# Altium schematic sheet HVSUP_ISOL.schdoc: HVPSU_ISOL v1.0
size 420 x 297 mm; EDA_Number: ARTIQ; Projet: HVPSU_ISOL; Author: G.Kasprowicz; CompanyName: WUT ISE; DrawnBy: G.Kasprowicz; Organization: WUT ISE; Address1: PW ISE; Address2: Nowowiejska 15/19 00-665 Warsaw; Address3: gkasprow@gmail.com; DocumentNumber: 1; Revision: 1.0; SheetNumber: 1; SheetTotal: 11; ModifiedBy: -; CheckedDate: -; Title2: Top; DivGrp: WUT ISE; Designer: G.Kasprowicz; ModifiedDate: -; ProjectName: Sensor Box
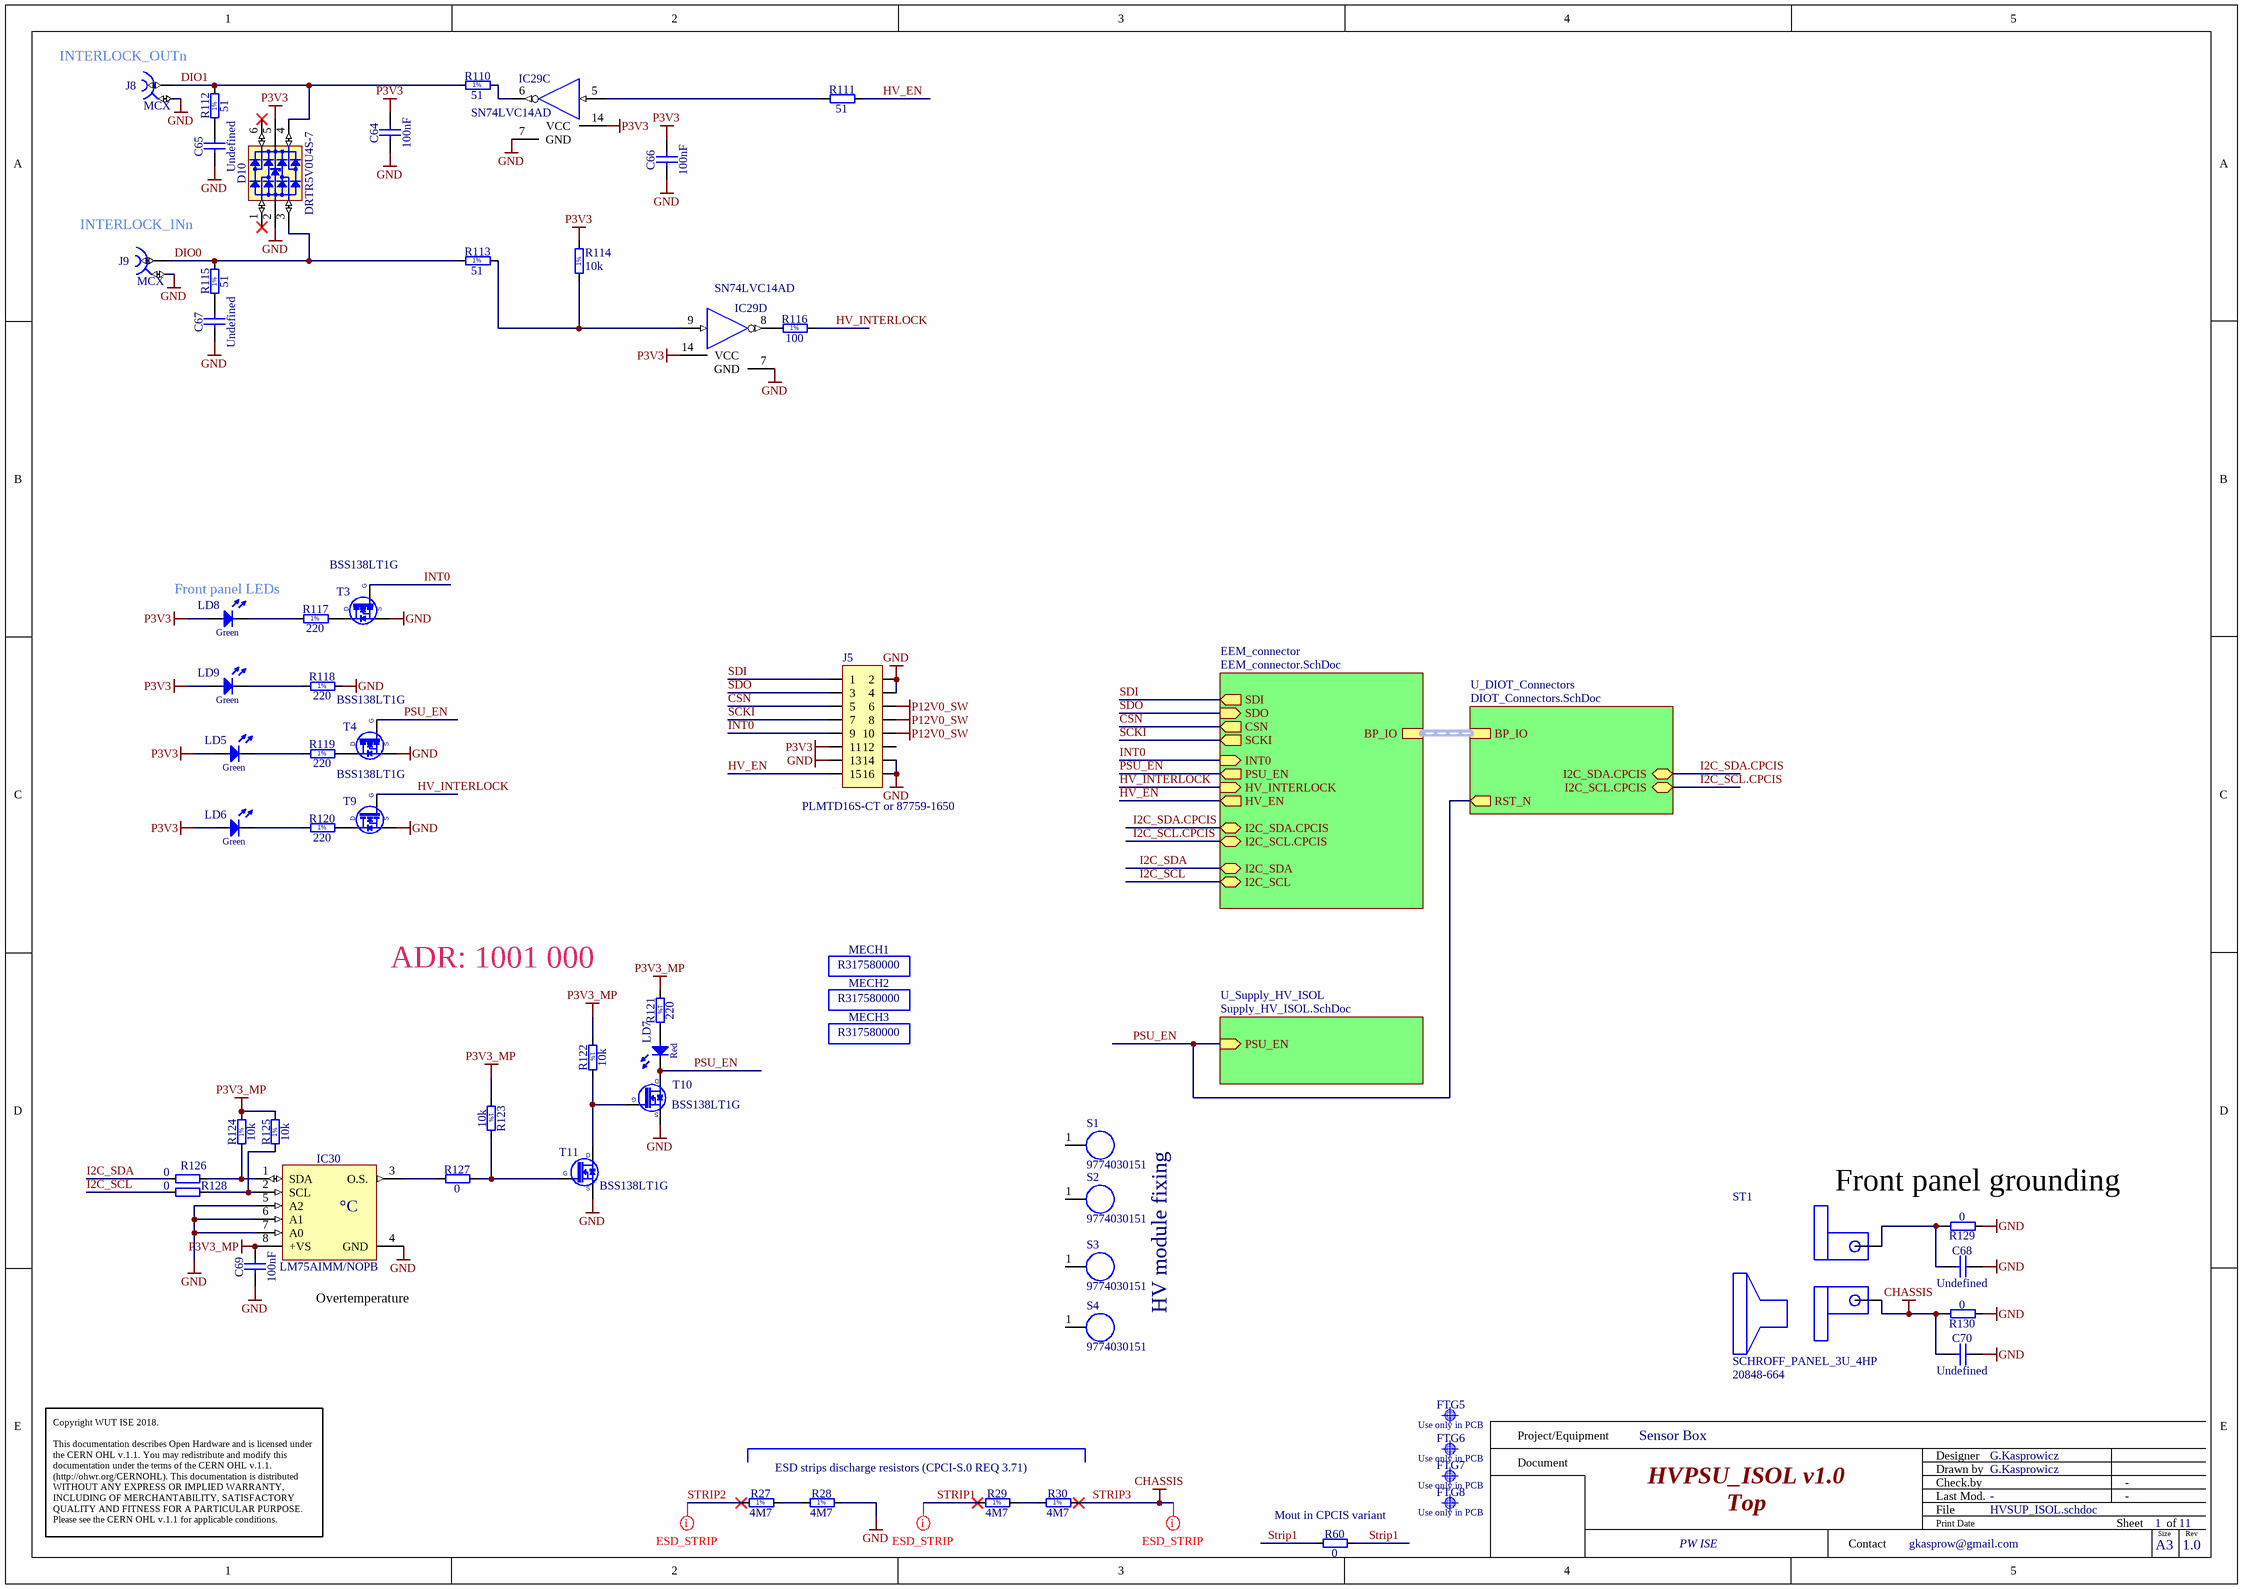
[diagram p0: HVSUP_ISOL.schdoc]

## Parts
C64  100nF  [CAPC1005X55N]
C65  Undefined  [CAPC1608X90N]
C66  100nF  [CAPC1005X55N]
C67  Undefined  [CAPC1608X90N]
C68  Undefined  [CAPC2012X135N]
C69  100nF  [CAPC1005X55N]
C70  Undefined  [CAPC2012X135N]
D10  DRTR5V0U4S-7  [SOT65P210X110-6N]
FTG5  Use only in PCB  [FIDUCIAL_TOP_C100-200]  (no BOM)
FTG6  Use only in PCB  [FIDUCIAL_TOP_S100-200]  (no BOM)
FTG7  Use only in PCB  [FIDUCIAL_TOP_S100-200]  (no BOM)
FTG8  Use only in PCB  [FIDUCIAL_TOP_S100-200]  (no BOM)
IC29  SN74LVC14AD  [SOIC127P600X175-14N]  (parts C,D of 6)
IC30  LM75AIMM/NOPB  [SOP65P490X109-8N]
J5  PLMTD16S-CT or 87759-1650  [87759-1650]
J8  MCX  [AMPHENOL_919-383J-51A]
J9  MCX  [AMPHENOL_919-383J-51A]
LD5  Green  [LED_DIALIGHT_555-230]
LD6  Green  [LED_DIALIGHT_555-230]
LD7  Red  [LED_DIALIGHT_555-200]
LD8  Green  [LED_DIALIGHT_555-230]
LD9  Green  [LED_DIALIGHT_555-230]
MECH1  R317580000  [GENERIC_MECH]
MECH2  R317580000  [GENERIC_MECH]
MECH3  R317580000  [GENERIC_MECH]
R27  4M7  [RESC2113X55N]
R28  4M7  [RESC2113X55N]
R29  4M7  [RESC2113X55N]
R30  4M7  [RESC2113X55N]
R60  0  [RESC2012X60N]
R110  51  [RESC1005X40N]
R111  51  [RESC1005X40N]
R112  51  [RESC1005X40N]
R113  51  [RESC1005X40N]
R114  10k  [RESC1005X40N]
R115  51  [RESC1005X40N]
R116  100  [RESC1005X40N]
R117  220  [RESC1608X55N]
R118  220  [RESC1608X55N]
R119  220  [RESC1608X55N]
R120  220  [RESC1608X55N]
R121  220  [RESC1608X55N]
R122  10k  [RESC1005X40N]
R123  10k  [RESC1005X40N]
R124  10k  [RESC1005X40N]
R125  10k  [RESC1005X40N]
R126  0  [RESC1005X40N]
R127  0  [RESC1005X40N]
R128  0  [RESC1005X40N]
R129  0  [RESC1608X55N]
R130  0  [RESC1608X55N]
S1  9774030151  [9774030151]
S2  9774030151  [9774030151]
S3  9774030151  [9774030151]
S4  9774030151  [9774030151]
ST1  SCHROFF_PANEL_3U_4HP  Manufacturer Part Number 2: 20848-664  [SCHROFF_PANEL_3HP_4U]
T3  BSS138LT1G  [SOT95P240X110-3N]
T4  BSS138LT1G  [SOT95P240X110-3N]
T9  BSS138LT1G  [SOT95P240X110-3N]
T10  BSS138LT1G  [SOT95P240X110-3N]
T11  BSS138LT1G  [SOT95P240X110-3N]

## Sub-sheets
EEM_connector = EEM_connector.SchDoc: SCKI (out), SDI (out), CSN (out), SDO (in), INT0 (in), PSU_EN (out), HV_INTERLOCK (in), HV_EN (out), BP_IO (harness BP_Conn), I2C_SDA.CPCIS (bidir), I2C_SCL.CPCIS (bidir), I2C_SDA (bidir), I2C_SCL (bidir)
U_DIOT_Connectors = DIOT_Connectors.SchDoc: BP_IO (harness BP_Conn), I2C_SDA.CPCIS (bidir), I2C_SCL.CPCIS (bidir), RST_N (out)
U_Supply_HV_ISOL = Supply_HV_ISOL.SchDoc: PSU_EN (in)

## Nets
GND: C64.1 C65.1 C66.1 C67.1 C68.2 C69.1 C70.2 D10.2(GND) IC29.7(GND) IC30.4(GND) IC30.5(A2) IC30.6(A1) IC30.7(A0) J5.2 J5.4 J5.13 J5.14 J5.16 J8.2 J9.2 R28.2 R118.2 R129.1 R130.1 T3.2(S) T4.2(S) T9.2(S) T10.2(S) T11.2(S)
P3V3: C64.2 C66.2 D10.5(VBUS) IC29.14(VCC) J5.11 LD5.2(A) LD6.2(A) LD8.2(A) LD9.2(A) R114.2
P3V3_MP: C69.2 IC30.8(+VS) R121.1 R122.1 R123.1 R124.2 R125.2
P12V0_SW: J5.6 J5.8 J5.10
STRIP3: C70.1 R30.2 R130.2 ST1.0  [also labelled CHASSIS]
CSN: J5.5 ; sheet EEM_connector/CSN
DIO0: D10.3(I/O2) J9.1 R113.1 R115.2
DIO1: D10.4(I/O3) J8.1 R110.1 R112.2
HV_EN: J5.15 R111.2 ; sheet EEM_connector/HV_EN
HV_INTERLOCK: R116.2 T9.1(G) ; sheet EEM_connector/HV_INTERLOCK
I2C_SCL: R128.1 ; sheet EEM_connector/I2C_SCL
I2C_SCL.CPCIS: sheet EEM_connector/I2C_SCL.CPCIS, sheet U_DIOT_Connectors/I2C_SCL.CPCIS
I2C_SDA: R126.1 ; sheet EEM_connector/I2C_SDA
I2C_SDA.CPCIS: sheet EEM_connector/I2C_SDA.CPCIS, sheet U_DIOT_Connectors/I2C_SDA.CPCIS
INT0: J5.9 T3.1(G) ; sheet EEM_connector/INT0
PSU_EN: LD7.1(C) T4.1(G) T10.3(D) ; sheet EEM_connector/PSU_EN, sheet U_Supply_HV_ISOL/PSU_EN, sheet U_DIOT_Connectors/RST_N
SCKI: J5.7 ; sheet EEM_connector/SCKI
SDI: J5.1 ; sheet EEM_connector/SDI
SDO: J5.3 ; sheet EEM_connector/SDO
STRIP1: R29.1 R60.1 R60.2
STRIP2: R27.1
NetC65_2: C65.2 R112.1
NetC67_2: C67.2 R115.1
NetC68_1: C68.1 R129.2 ST1.1
NetIC29_5: IC29.5(IN) R111.1
NetIC29_6: IC29.6(OUT) R110.2
NetIC29_8: IC29.8(OUT) R116.1
NetIC29_9: IC29.9(IN) R113.2 R114.1
NetIC30_1: IC30.1(SDA) R124.1 R126.2
NetIC30_2: IC30.2(SCL) R125.1 R128.2
NetIC30_3: IC30.3(O.S.) R127.1
NetLD5_1: LD5.1(C) R119.1
NetLD6_1: LD6.1(C) R120.1
NetLD7_2: LD7.2(A) R121.2
NetLD8_1: LD8.1(C) R117.1
NetLD9_1: LD9.1(C) R118.1
NetR27_2: R27.2 R28.1
NetR29_2: R29.2 R30.1
NetR117_2: R117.2 T3.3(D)
NetR119_2: R119.2 T4.3(D)
NetR120_2: R120.2 T9.3(D)
NetR122_2: R122.2 T10.1(G) T11.3(D)
NetR123_2: R123.2 R127.2 T11.1(G)

Not connected (* = marked no-connect by the designer): D10 1(I/O1)* 6(I/O4)*; J5 12; S1 1; S2 1; S3 1; S4 1

## Buses and harness runs
harness sheet EEM_connector/BP_IO = sheet U_DIOT_Connectors/BP_IO

## Layout directives
net class ESD_STRIP: STRIP1, STRIP2, STRIP3

## Notes on the sheet
- (near J8) INTERLOCK_OUTn
- (near J9) INTERLOCK_INn
- Front panel LEDs
- ADR: 1001 000
- (near R129) Front panel grounding
- Overtemperature
- HV module fixing
- ESD strips discharge resistors (CPCI-S.0 REQ 3.71)
- (near R60) Mout in CPCIS variant
- Project/Equipment
- Document
- Designer
- Drawn by
- Check.by
- Copyright WUT ISE 2018.
  This documentation describes Open Hardware and is licensed under the CERN OHL v.1.1. You may redistribute and modify this documentation under the terms of the CERN OHL v.1.1. (http://ohwr.org/CERNOHL). This documentation is distributed WITHOUT ANY EXPRESS OR IMPLIED WARRANTY, INCLUDING OF MERCHANTABILITY, SATISFACTORY QUALITY AND FITNESS FOR A PARTICULAR PURPOSE. Please see the CERN OHL v.1.1 for applicable conditions.
- Contact
- File
- Last Mod.
- Print Date
- Sheet
- Size
- A3
- of
- Rev
- (in symbol LM75AIMM/NOPB) °C
- (in symbol R0402_10K_1%_0.0625W_100PPM) 1%
- (in symbol R0402_51R_1%_0.0625W_100PPM) 1%
- (in symbol R0402_100R_1%_0.0625W_100PPM) 1%
- (in symbol R0603_220R_1%_0.1W_100PPM) 1%
- (in symbol R0805_4M7_1%_0.125W_100PPM_VISHAY_CRCW e3) 1%

## Library data of the parts
C64 C66 = CC0402_100NF_16V_10%_X7R: Non-polarised capacitor; Part Description: SMD Multilayer Chip Ceramic Capacitor; Manufacturer: GENERIC; Manufacturer1 Part Number: GRM155R71C104KA88D; Voltage: 16V; TC: X7R; Tolerance: ±10%; Part Number: CC0402_100NF_16V_10%_X7R; Component Kind: Standard; Component Type: Standard; Pin Count: 2; Value: 100nF; Status: Not Recommended; Manufacturer Part Number: CC0402_100NF_16V_10%_X7R; Case: 0402; Mounted: Yes; Socket: No; SMD: Yes; Sense: No; Manufacturer1 Example: MURATA; Manufacturer1 ComponentHeight: 0.55mm; HelpURL: \\cern.ch\dfs\Applications\Altium\Datasheets\CC0402_X7R_MURATA_GRM.pdf; Author: CERN DEM JLC; CreateDate: 05.12.2013; LatestRevisionDate: 03.12.2007
C65 C67 = CC0603_NO-VALUE: Non-polarised capacitor; Part Description: Reserved Footprint For 0603(1608) Chip Ceramic Capacitor; Mounted: No; Part Number: CC0603_NO-VALUE; Component Kind: Standard; Component Type: Standard; Pin Count: 2; Value: Undefined; Status: None; Manufacturer: Undefined; Manufacturer Part Number: CC0603_NO-VALUE; Case: 0603; Socket: No; SMD: Yes; Sense: No; Manufacturer1 ComponentHeight: 0.9mm; HelpURL: Undefined; Author: CERN DEM MR; CreateDate: 22.11.2016; LatestRevisionDate: 22.11.2016
C68 C70 = CC0805_NO-VALUE: Non-polarised capacitor; Part Description: Reserved Footprint For 0805(2012) Chip Ceramic Capacitor; Mounted: No; Part Number: CC0805_NO-VALUE; Component Kind: Standard; Component Type: Standard; Pin Count: 2; Value: Undefined; Status: None; Manufacturer: Undefined; Manufacturer Part Number: CC0805_NO-VALUE; Case: 0805; Socket: No; SMD: Yes; Sense: No; Manufacturer1 ComponentHeight: 1.35mm; HelpURL: Undefined; Author: CERN DEM JLC; CreateDate: 10.12.2008; LatestRevisionDate: 11.09.2013
C69 = CC0402_100NF_16V_10%_X5R: Non-polarised capacitor; Part Description: SMD Multilayer Chip Ceramic Capacitor; Manufacturer: GENERIC; Manufacturer1 Part Number: GRM155R61C104KA88D; Voltage: 16V; TC: X5R; Tolerance: ±10%; Part Number: CC0402_100NF_16V_10%_X5R; Component Kind: Standard; Component Type: Standard; Pin Count: 2; Value: 100nF; Status: None; Manufacturer Part Number: CC0402_100NF_16V_10%_X5R; Case: 0402; Mounted: Yes; Socket: No; SMD: Yes; Sense: No; Manufacturer1 Example: MURATA; Manufacturer1 ComponentHeight: 0.55mm; HelpURL: \\cern.ch\dfs\Applications\Altium\Datasheets\CC0402_X5R_MURATA_GRM.pdf; Author: CERN DEM JLC; CreateDate: 10.12.2013; LatestRevisionDate: 10.12.2013
D10 = D_TVS_DRTR5V0U4S-7: Integrated Quad Ultra-Low Capacitance ESD Protection; Part Description: Integrated Quad Ultra-Low Capacitance ESD (±8kV) Protection; Manufacturer: DIODES; PressFit: No; Bonding: No; Status Comment: Active; Part Number: DRTR5V0U4S-7; Component Kind: Standard; Component Type: Standard; Device: DRTR5V0U4S-7; PackageDescription: SOT363, SC70-6, 0.65mm Pitch; 6 Pin, 1.25mm W X 2.00mm L X 1.10mm H body, IPC Medium Density; Status: Active; Manufacturer Part Number: DRTR5V0U4S-7; Pin Count: 6; Case: SOT363; Mounted: Yes; Socket: No; SMD: Yes; Sense: No; ComponentHeight: 1.1mm; HelpURL: \\cern.ch\dfs\Applications\Altium\Datasheets\PRTR5V0U4Y.pdf; Author: GK; CreateDate: 24.01.2017; LatestRevisionDate: 14.09.2020
FTG5 = FIDUCIAL_TARGET_C100-200: Fiducial Target; Part Description: Round Fiducial Target, Top Layer, 1.0mm, Top Solder 2.0mm, Keepout =2.0mm; Mounted: No; Part Number: FIDUCIAL_TARGET_C100-200; Component Type: Standard (No BOM); Pin Count: 1; Family: Fiducial; Socket: No; SMD: Yes; Sense: No; Status: None; ComponentHeight: 0mm; HelpURL: Undefined; Author: CERN DEM JLC; CreateDate: 09.02.2010; LatestRevisionDate: 04.04.2012; PackageDescription: Round Fiducial Target, Top Layer, 1.0mm, Top Solder 2.0mm, Keepout =2.0mm
FTG6-FTG8 = FIDUCIAL_TARGET_S100-200: Fiducial Target; Part Description: Square Fiducial Target, Top Layer, 1.0mm, Top Solder 2.0mm, Keepout =2.0mm; Mounted: No; Part Number: FIDUCIAL_TARGET_S100-200; Component Type: Standard (No BOM); Pin Count: 1; Family: Fiducial; Socket: No; SMD: Yes; Sense: No; Status: None; ComponentHeight: 0mm; HelpURL: Undefined; Author: CERN DEM JLC; CreateDate: 09.02.2010; LatestRevisionDate: 04.04.2012; PackageDescription: Square Fiducial Target, Top Layer, 1.0mm, Top Solder 2.0mm, Keepout =2.0mm
IC29 = SN74LVC14AD: Hex Schmitt-Trigger Inverter; Manufacturer: TEXAS INSTRUMENTS; PressFit: No; Bonding: No; Part Number: SN74LVC14AD; Component Kind: Standard; Component Type: Standard; Device: SN74LVC14AD; PackageDescription: SOIC 14, Pitch 1.27mm - Body 4x8.75mm, IPC Medium Density; Part Description: Hex Schmitt-Trigger Inverter; Manufacturer Part Number: SN74LVC14AD; Pin Count: 14; Case: SOIC14; Mounted: Yes; Socket: No; SMD: Yes; Sense: No; ComponentHeight: 1.75mm; Author: CERN DEM JMW; HelpURL: \\cern.ch\dfs\Applications\Altium\Datasheets\SN74LVC14AD.pdf; CreateDate: 29.09.2008; LatestRevisionDate: 29.09.2008
IC30 = LM75AIMM/NOPB: Digital Temperature Sensor and Thermal Watchdog with Two-Wire Interface; Part Description: -25° to +100°C ±2°C Digital Temperature Sensor and Thermal Watchdog with Two-Wire Interface; Manufacturer: TEXAS INSTRUMENTS; PressFit: No; Bonding: No; Part Number: LM75AIMM/NOPB; Component Kind: Standard; Component Type: Standard; Device: LM75AIMM/NOPB; PackageDescription: SOP, 0.65mm pitch; 8 pin,3.00mm W X 3.00mm L X 1.09mm H bodyI, PC Medium Density; Manufacturer Part Number: LM75AIMM/NOPB; Pin Count: 8; Case: SSOP8; Mounted: Yes; Socket: No; SMD: Yes; Sense: No; ComponentHeight: 1.09mm; HelpURL: \\cern.ch\dfs\Applications\Altium\Datasheets\LM75AIMM-NOPB.pdf; Author: CERN DEM JLC; CreateDate: 15.10.2012; LatestRevisionDate: 15.10.2012
J5 = CON_2x8 2mm male: 2mm  dual row rheader (Maritex); Manufacturer: Molex; Pitch Spacing: 2; No. of Contacts: 16; Gender: Header; Contact Termination: SMT Vertical; Manufacturer Part Number: 87759-1650; RoHS: YES; No. of Rows: 2; Contact Plating: Gold; Contact Material: Phosphor Bronze; Supplier 1: Mouser; Supplier Part Number 1: 538-87759-1650
J8 J9 = AMPHENOL_919-383J-51A: Part Description: 50 Ohm, RF Connector, MCX Right Angle PCB Receptacle Jack; PressFit: No; Part Number: AMPHENOL_919-383J-51A; Component Kind: Standard; Component Type: Standard; Pin Count: 5; Family: MCX; Mounted: Yes; Socket: No; SMD: No; Sense: No; Status: None; Manufacturer: AMPHENOL; Manufacturer Part Number: 919-383J-51A; ComponentHeight: 6mm; HelpURL: \\cern.ch\dfs\Applications\Altium\Datasheets\AMPHENOL_919-383J-51A.pdf; Author: CERN DEM BC; CreateDate: 31.01.2019; LatestRevisionDate: 31.01.2019
LD5 LD6 LD8 LD9 = LED_DIALIGHT_555-2301F: LED Green 1C 2A; Part Description: Single 2mm Green LED CBI® Circuit Board Indicator; PressFit: No; Bonding: No; Part Number: LED_DIALIGHT_555-2301F; Component Kind: Standard; Component Type: Standard; Color: Green; PackageDescription: Single 2mm Green LED, Body 5.08x2.54mm, Pin spacing 2.54mm; Manufacturer: DIALIGHT; Manufacturer Part Number: 555-2301F; Pin Count: 2; Mounted: Yes; Socket: No; SMD: No; Sense: No; ComponentHeight: 6.35mm; HelpURL: \\cern.ch\dfs\Applications\Altium\Datasheets\LED_DIALIGHT_555-2301F.pdf; Author: CERN DEM JMW; CreateDate: 22.09.2008; LatestRevisionDate: 17.03.2010
LD7 = LED_DIALIGHT_555-2001F: LED Red 1C 2A; Part Description: Single 2mm Red LED CBI® Circuit Board Indicator; PressFit: No; Bonding: No; Part Number: LED_DIALIGHT_555-2001F; Component Kind: Standard; Component Type: Standard; Color: Red; PackageDescription: Single 2mm Red LED, Body 5.08x2.54mm, Pin spacing 2.54mm; Manufacturer: DIALIGHT; Manufacturer Part Number: 555-2001F; Pin Count: 2; Mounted: Yes; Socket: No; SMD: No; Sense: No; ComponentHeight: 6.35mm; HelpURL: \\cern.ch\dfs\Applications\Altium\Datasheets\LED_DIALIGHT_555-2001F.pdf; Author: CERN DEM JMW; CreateDate: 22.09.2008; LatestRevisionDate: 17.03.2010
MECH1-MECH3 = Generic_mechanical: SHV connector; Part Description: SHV panel connector; Manufacturer: Radiall; PressFit: No; Part Number: R317580000; Component Kind: SHV connector; Component Type: Standard; Footprint: generic_MECH; Pin Count: 0; PackageDescription: SHV; Mounted: Yes; Socket: No; SMD: No; Sense: No; Status: None; Value: R317580000; Manufacturer Part Number: R317580000; ComponentHeight: generic; Author: GK; CreateDate: 28.10.2019; LatestRevisionDate: 28.10.2019
R27-R30 = R0805_4M7_1%_0.125W_100PPM_VISHAY_CRCW e3: Resistor - 1%; Part Description: 150V, Standard Thick Film Chip Resistor; Manufacturer: VISHAY; Manufacturer Part Number: CRCW08054M70FKEA; Power: 0.125W; TC: ±100ppm/°C; PressFit: No; Part Number: R0805_4M7_1%_0.125W_100PPM_VISHAY_CRCW e3; Component Kind: Standard; Component Type: Standard; Pin Count: 2; Value: 4M7; Status: None; Tolerance: ±1%; Case: 0805; Mounted: Yes; Sense: No; Socket: No; SMD: Yes; ComponentHeight: 0.5mm; HelpURL: \\cern.ch\dfs\Applications\Altium\Datasheets\R0805_VISHAY_CRCW e3.pdf; Author: CERN DEM BR; CreateDate: 27/05/2019; LatestRevisionDate: 27/05/2019
R60 = R0805_0R_JUMPER: Resistor; Part Description: 2A (0.05R Max DC Resistance) Zero Ohm Jumper; Manufacturer: GENERIC; Manufacturer1 Part Number: NRC10Z0; PressFit: No; Part Number: R0805_0R_JUMPER; Component Kind: Standard; Component Type: Standard; Pin Count: 2; Value: 0; Status: Preferred; Manufacturer Part Number: R0805_0R_JUMPER; Case: 0805; Mounted: Yes; Sense: No; Socket: No; SMD: Yes; Manufacturer1 Example: NIC COMPONENT; Manufacturer1 ComponentHeight: 0.6mm; HelpURL: \\cern.ch\dfs\Applications\Altium\Datasheets\R0805_NIC_NRC.pdf; Author: CERN DEM JLC; CreateDate: 03.12.2007; LatestRevisionDate: 13.03.2008
R110-R113 R115 = R0402_51R_1%_0.0625W_100PPM: Resistor - 1%; Part Description: General Purpose Thick Film Chip Resistor; Manufacturer: GENERIC; Manufacturer1 Part Number: 232270675109L; TC: ±100ppm/°C; PressFit: No; Part Number: R0402_51R_1%_0.0625W_100PPM; Component Kind: Standard; Component Type: Standard; Pin Count: 2; Value: 51; Status: Not Recommended; Power: 0.0625W; Tolerance: ±1%; Manufacturer Part Number: R0402_51R_1%_0.0625W_100PPM; Case: 0402; Mounted: Yes; Sense: No; Socket: No; SMD: Yes; Manufacturer1 Example: YAGEO PHYCOMP; Manufacturer1 ComponentHeight: 0.4mm; HelpURL: \\cern.ch\dfs\Applications\Altium\Datasheets\R0402_Phycomp_RC0402.pdf; Author: CERN DEM JLC
  R110 R112 R113 R115: CreateDate: 03/12/2007; LatestRevisionDate: 17/10/2012
  R111: CreateDate: 03.12.2007; LatestRevisionDate: 17.10.2012
R114 = R0402_10K_1%_0.0625W_100PPM: Resistor - 1%; Part Description: General Purpose Thick Film Chip Resistor; Manufacturer: GENERIC; Manufacturer1 Part Number: 232270671003L; TC: ±100ppm/°C; Part Number: R0402_10K_1%_0.0625W_100PPM; Component Kind: Standard; Component Type: Standard; Pin Count: 2; Value: 10k; Status: Not recommended; Power: 0.0625W; Tolerance: ±1%; Manufacturer Part Number: R0402_10K_1%_0.0625W_100PPM; Case: 0402; Mounted: Yes; Sense: No; Socket: No; SMD: Yes; Manufacturer1 Example: YAGEO PHYCOMP; Manufacturer1 ComponentHeight: 0.4mm; HelpURL: \\cern.ch\dfs\Applications\Altium\Datasheets\R0402_Phycomp_RC0402.pdf; Author: CERN DEM JLC; CreateDate: 03.12.2007; LatestRevisionDate: 17.10.2012
R116 = R0402_100R_1%_0.0625W_100PPM: Resistor - 1%; Part Description: General Purpose Thick Film Chip Resistor; Manufacturer: GENERIC; Manufacturer1 Part Number: 232270671001L; TC: ±100ppm/°C; PressFit: No; Part Number: R0402_100R_1%_0.0625W_100PPM; Component Kind: Standard; Component Type: Standard; Pin Count: 2; Value: 100; Status: Not Recommended; Power: 0.0625W; Tolerance: ±1%; Manufacturer Part Number: R0402_100R_1%_0.0625W_100PPM; Case: 0402; Mounted: Yes; Sense: No; Socket: No; SMD: Yes; Manufacturer1 Example: YAGEO PHYCOMP; Manufacturer1 ComponentHeight: 0.4mm; HelpURL: \\cern.ch\dfs\Applications\Altium\Datasheets\R0402_Phycomp_RC0402.pdf; Author: CERN DEM JLC; CreateDate: 03.12.2007; LatestRevisionDate: 17.10.2012
R117-R121 = R0603_220R_1%_0.1W_100PPM: Resistor - 1%; Part Description: General Purpose Thick Film Chip Resistor; Manufacturer: GENERIC; Manufacturer1 Part Number: NRC06F2200TRF; Power: 0.1W; TC: ±100ppm/°C; Part Number: R0603_220R_1%_0.1W_100PPM; Component Kind: Standard; Component Type: Standard; Pin Count: 2; Value: 220; Status: Preferred; Tolerance: ±1%; Manufacturer Part Number: R0603_220R_1%_0.1W_100PPM; Case: 0603; Mounted: Yes; Sense: No; Socket: No; SMD: Yes; Manufacturer1 Example: NIC COMPONENT; Manufacturer1 ComponentHeight: 0.55mm; HelpURL: \\cern.ch\dfs\Applications\Altium\Datasheets\R0603_NIC_NRC.pdf; Author: CERN DEM JLC; CreateDate: 03.12.2007; LatestRevisionDate: 13.03.2008
R122-R125 = R0402_10K_1%_0.0625W_100PPM: Resistor - 1%; Part Description: General Purpose Thick Film Chip Resistor; Manufacturer: GENERIC; Manufacturer1 Part Number: 232270671003L; TC: ±100ppm/°C; PressFit: No; Part Number: R0402_10K_1%_0.0625W_100PPM; Component Kind: Standard; Component Type: Standard; Pin Count: 2; Value: 10k; Status: Not Recommended; Power: 0.0625W; Tolerance: ±1%; Manufacturer Part Number: R0402_10K_1%_0.0625W_100PPM; Case: 0402; Mounted: Yes; Sense: No; Socket: No; SMD: Yes; Manufacturer1 Example: YAGEO PHYCOMP; Manufacturer1 ComponentHeight: 0.4mm; HelpURL: \\cern.ch\dfs\Applications\Altium\Datasheets\R0402_Phycomp_RC0402.pdf; Author: CERN DEM JLC; CreateDate: 03.12.2007; LatestRevisionDate: 17.10.2012
R126-R128 = R0402_0R_JUMPER: Resistor; Part Description: 1A (0.05R Max DC Resistance) Zero Ohm Jumper; Manufacturer: GENERIC; Manufacturer1 Part Number: 232270591001L; Part Number: R0402_0R_JUMPER; Component Kind: Standard; Component Type: Standard; Pin Count: 2; Value: 0; Status: Not recommended; Manufacturer Part Number: R0402_0R_JUMPER; Case: 0402; Mounted: Yes; Sense: No; Socket: No; SMD: Yes; Manufacturer1 Example: YAGEO PHYCOMP; Manufacturer1 ComponentHeight: 0.4mm; HelpURL: \\cern.ch\dfs\Applications\Altium\Datasheets\R0402_Phycomp_RC0402.pdf; Author: CERN DEM JLC; CreateDate: 03.12.2007; LatestRevisionDate: 17.10.2012
R129 R130 = R0603_0R_JUMPER: Resistor; Part Description: 1A (0.05R Max DC Resistance) Zero Ohm Jumper; Manufacturer: GENERIC; Manufacturer1 Part Number: NRC06Z0; PressFit: No; Part Number: R0603_0R_JUMPER; Component Kind: Standard; Component Type: Standard; Pin Count: 2; Value: 0; Status: Preferred; Manufacturer Part Number: R0603_0R_JUMPER; Case: 0603; Mounted: Yes; Sense: No; Socket: No; SMD: Yes; Manufacturer1 Example: NIC COMPONENT; Manufacturer1 ComponentHeight: 0.55mm; HelpURL: \\cern.ch\dfs\Applications\Altium\Datasheets\R0603_NIC_NRC.pdf; Author: CERN DEM JLC; CreateDate: 03.12.2007; LatestRevisionDate: 13.03.2008
S1-S4 = WA-SMSI,  9774030151: WA-SMSI SMD Steel Spacer with internal Thread; Manufacturer: Wurth Elektronik; partNo: 9774030151; ComponentLink1Description: Manufacturer; ComponentLink1URL: http://www.we-online.de; Created by: Baojun Chen; Created Date: 20.Oct.2015; ComponentLink2Description: Datasheet; ComponentLink2URL: http://katalog.we-online.de/em/datasheet/9774030151.pdf
ST1 = SCHROFF_PANEL_3U_4HP: Schroff 3HP 4U EUROCARD Panel Kit; Manufacturer Part Number: 20818-017; Manufacturer: Schroff
T3 T4 T9-T11 = BSS138LT1G: N-CHANNEL MOSFET WITH DIODE; Part Description: 50V 200mA N-Channel Enhancement Mode Field-Effect Transistor; Manufacturer: ON SEMICONDUCTOR; PressFit: No; Bonding: No; Part Number: BSS138LT1G; Component Kind: Standard; Component Type: Standard; Device: BSS138LT1G; PackageDescription: SOT23 3-Leads, Pitch 0.95mm - Body 1.4x3mm, IPC Medium Density; Manufacturer Part Number: BSS138LT1G; Pin Count: 3; Case: SOT23-3; Mounted: Yes; Socket: No; SMD: Yes; Sense: No; ComponentHeight: 1.11mm; HelpURL: \\cern.ch\dfs\Applications\Altium\Datasheets\BSS138LT1G.pdf; Author: CERN DEM JLC; CreateDate: 23.03.2009; LatestRevisionDate: 23.03.2009